# EAGLE schematic picoKey_230404 (EAGLE 9.6.2)
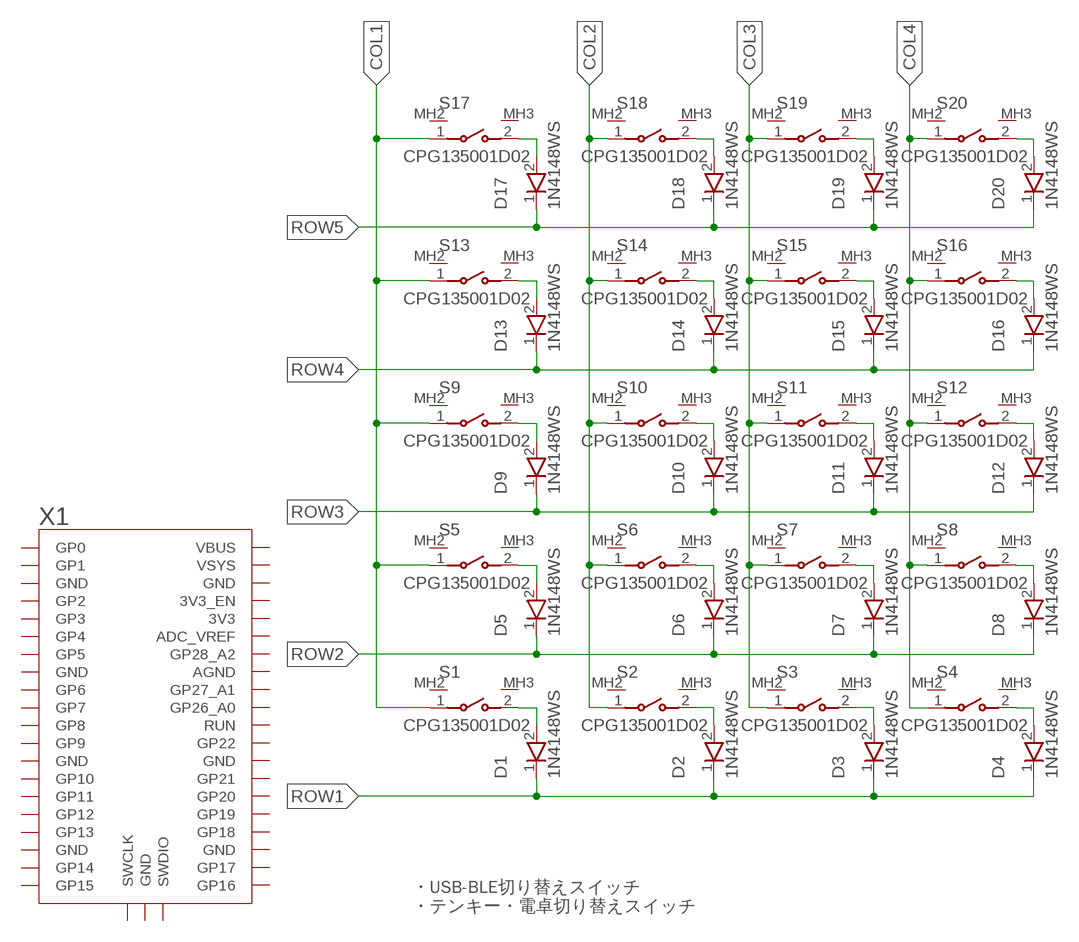
[diagram p0: schematic, sheet 1]

## Parts
D1  1N4148WS  [SODFL2512X90N]
D2  1N4148WS  [SODFL2512X90N]
D3  1N4148WS  [SODFL2512X90N]
D4  1N4148WS  [SODFL2512X90N]
D5  1N4148WS  [SODFL2512X90N]
D6  1N4148WS  [SODFL2512X90N]
D7  1N4148WS  [SODFL2512X90N]
D8  1N4148WS  [SODFL2512X90N]
D9  1N4148WS  [SODFL2512X90N]
D10  1N4148WS  [SODFL2512X90N]
D11  1N4148WS  [SODFL2512X90N]
D12  1N4148WS  [SODFL2512X90N]
D13  1N4148WS  [SODFL2512X90N]
D14  1N4148WS  [SODFL2512X90N]
D15  1N4148WS  [SODFL2512X90N]
D16  1N4148WS  [SODFL2512X90N]
D17  1N4148WS  [SODFL2512X90N]
D18  1N4148WS  [SODFL2512X90N]
D19  1N4148WS  [SODFL2512X90N]
D20  1N4148WS  [SODFL2512X90N]
S1  CPG135001D02  [CPG135001D02]
S2  CPG135001D02  [CPG135001D02]
S3  CPG135001D02  [CPG135001D02]
S4  CPG135001D02  [CPG135001D02]
S5  CPG135001D02  [CPG135001D02]
S6  CPG135001D02  [CPG135001D02]
S7  CPG135001D02  [CPG135001D02]
S8  CPG135001D02  [CPG135001D02]
S9  CPG135001D02  [CPG135001D02]
S10  CPG135001D02  [CPG135001D02]
S11  CPG135001D02  [CPG135001D02]
S12  CPG135001D02  [CPG135001D02]
S13  CPG135001D02  [CPG135001D02]
S14  CPG135001D02  [CPG135001D02]
S15  CPG135001D02  [CPG135001D02]
S16  CPG135001D02  [CPG135001D02]
S17  CPG135001D02  [CPG135001D02]
S18  CPG135001D02  [CPG135001D02]
S19  CPG135001D02  [CPG135001D02]
S20  CPG135001D02  [CPG135001D02]
X1  RASPBERRYPI_PICO_RPI_PICO_IG-TH  [RASPBERRYPI_PICO_RPI_PICO_TH]

## Nets
COL1: S1.1 S5.1 S9.1 S13.1 S17.1
COL2: S2.1 S6.1 S10.1 S14.1 S18.1
COL3: S3.1 S7.1 S11.1 S15.1 S19.1
COL4: S4.1 S8.1 S12.1 S16.1 S20.1
N$5: D1.2(A) S1.2
N$6: D2.2(A) S2.2
N$7: D3.2(A) S3.2
N$8: D4.2(A) S4.2
N$9: D5.2(A) S5.2
N$10: D6.2(A) S6.2
N$11: D7.2(A) S7.2
N$12: D8.2(A) S8.2
N$13: D9.2(A) S9.2
N$14: D10.2(A) S10.2
N$15: D11.2(A) S11.2
N$16: D12.2(A) S12.2
N$17: D13.2(A) S13.2
N$18: D14.2(A) S14.2
N$19: D15.2(A) S15.2
N$20: D16.2(A) S16.2
N$21: D17.2(A) S17.2
N$22: D18.2(A) S18.2
N$24: D20.2(A) S20.2
N$25: D19.2(A) S19.2
ROW1: D1.1(K) D2.1(K) D3.1(K) D4.1(K)
ROW2: D5.1(K) D6.1(K) D7.1(K) D8.1(K)
ROW3: D9.1(K) D10.1(K) D11.1(K) D12.1(K)
ROW4: D13.1(K) D14.1(K) D15.1(K) D16.1(K)
ROW5: D17.1(K) D18.1(K) D19.1(K) D20.1(K)
Unconnected: S1.MH2(MH) S1.MH3(MH) S2.MH2(MH) S2.MH3(MH) S3.MH2(MH) S3.MH3(MH) S4.MH2(MH) S4.MH3(MH) S5.MH2(MH) S5.MH3(MH) S6.MH2(MH) S6.MH3(MH) S7.MH2(MH) S7.MH3(MH) S8.MH2(MH) S8.MH3(MH) S9.MH2(MH) S9.MH3(MH) S10.MH2(MH) S10.MH3(MH) S11.MH2(MH) S11.MH3(MH) S12.MH2(MH) S12.MH3(MH) S13.MH2(MH) S13.MH3(MH) S14.MH2(MH) S14.MH3(MH) S15.MH2(MH) S15.MH3(MH) S16.MH2(MH) S16.MH3(MH) S17.MH2(MH) S17.MH3(MH) S18.MH2(MH) S18.MH3(MH) S19.MH2(MH) S19.MH3(MH) S20.MH2(MH) S20.MH3(MH) X1.3V3 X1.3V3_EN X1.ADC_VREF X1.AGND X1.GND@1(GND) X1.GND@2(GND) X1.GND@3(GND) X1.GND@4(GND) X1.GND@5(GND) X1.GND@6(GND) X1.GND@7(GND) X1.GND@8(GND) X1.GP0 X1.GP1 X1.GP2 X1.GP3 X1.GP4 X1.GP5 X1.GP6 X1.GP7 X1.GP8 X1.GP9 X1.GP10 X1.GP11 X1.GP12 X1.GP13 X1.GP14 X1.GP15 X1.GP16 X1.GP17 X1.GP18 X1.GP19 X1.GP20 X1.GP21 X1.GP22 X1.GP26_A0 X1.GP27_A1 X1.GP28_A2 X1.RUN X1.SWCLK X1.SWDIO X1.VBUS X1.VSYS

## Notes on the sheet
- ・USB-BLE切り替えスイッチ
  ・テンキー・電卓切り替えスイッチ

## Library data of the parts
D1-D20 = SamacSys_Parts:1N4148WS: ON Semiconductor Switching Diode, 300mA 75V, 2-Pin SOD-323 1N4148WS Source: Datasheet; ARROW_PART_NUMBER: 1N4148WS; ARROW_PRICE-STOCK: https://www.arrow.com/en/products/1n4148ws/on-semiconductor?region=europe; DESCRIPTION: ON Semiconductor Switching Diode, 300mA 75V, 2-Pin SOD-323 1N4148WS; HEIGHT: 0.9mm; MANUFACTURER_NAME: onsemi; MANUFACTURER_PART_NUMBER: 1N4148WS; MOUSER_PART_NUMBER: 512-1N4148WS; MOUSER_PRICE-STOCK: https://www.mouser.co.uk/ProductDetail/onsemi-Fairchild/1N4148WS?qs=2%2FYqgE%252BHg%252BKBrKZlAsMLhw%3D%3D
S1-S20 = picoKey:CPG135001D02: Through Hole Tactile Switches RoHS Source: Datasheet <https://datasheet.lcsc.com/szlcsc/1910111742_Kailh-CPG135001D02_C400230.pdf>; DESCRIPTION: Through Hole Tactile Switches RoHS; HEIGHT: 8mm; MANUFACTURER_NAME: Kailh; MANUFACTURER_PART_NUMBER: CPG135001D02
X1 = picoKey:RASPBERRYPI_PICO_RPI_PICO_IG